# Altium schematic sheet STM32核心系统.SchDoc
size A4
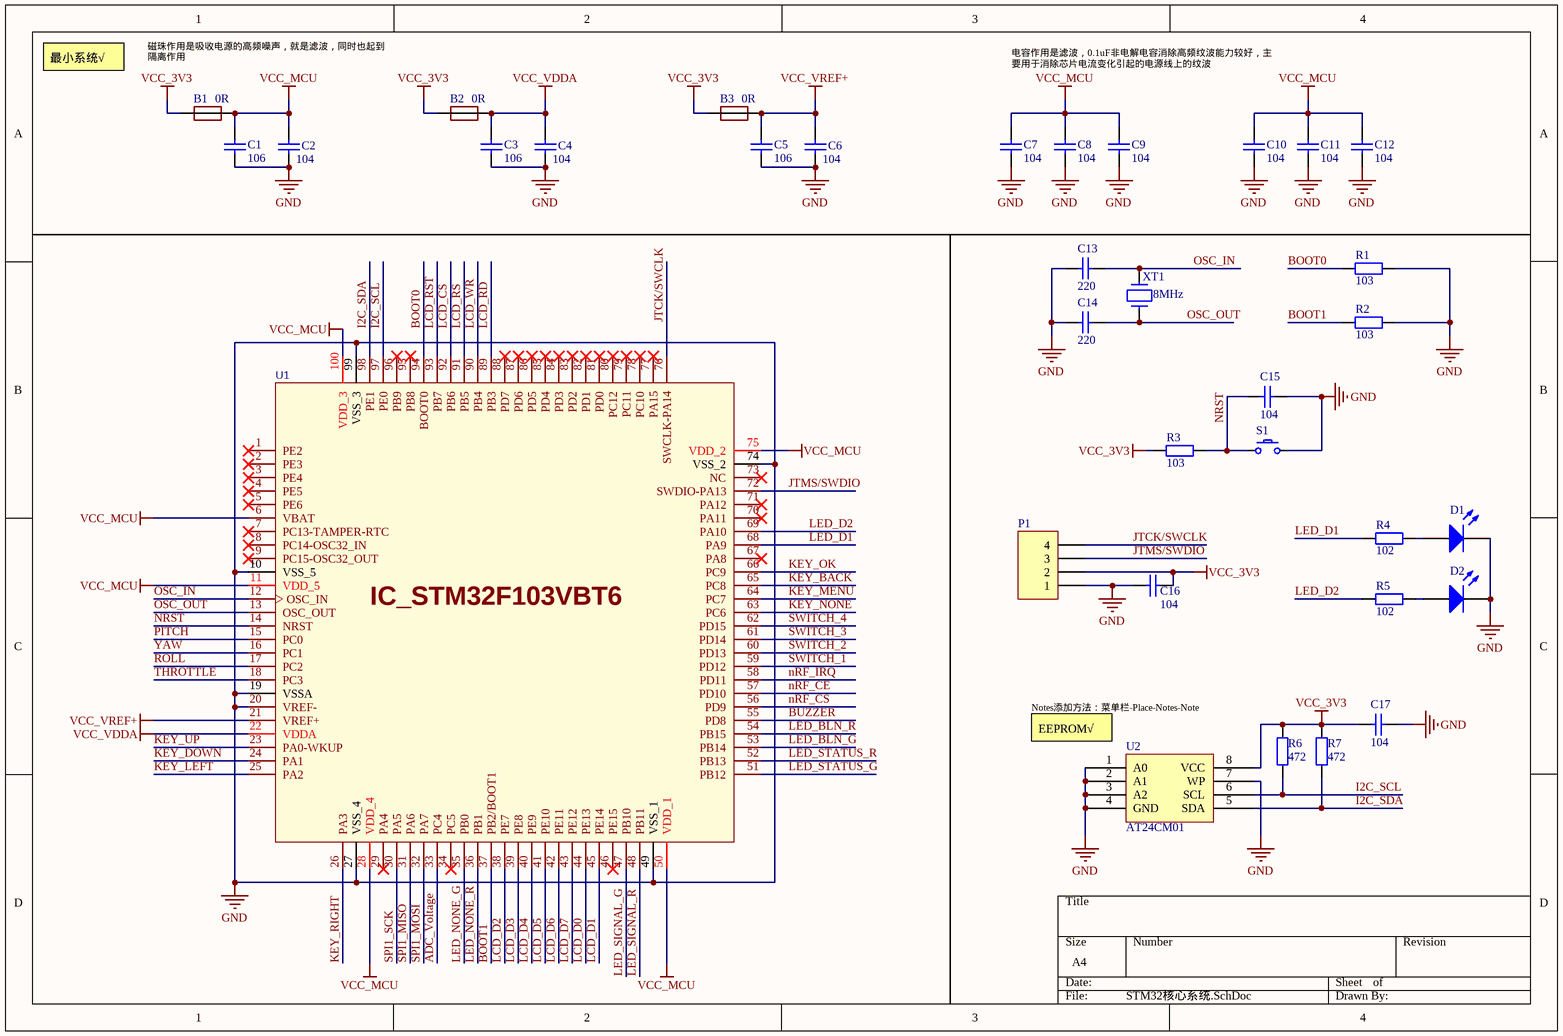
[diagram p0: STM32核心系统.SchDoc]

## Parts
B1  value 0R  [CC1608-0603]  (hidden comment: MPZ1608S101ATDH5)
B2  value 0R  [CC1608-0603]  (hidden comment: MPZ1608S101ATDH5)
B3  value 0R  [CC1608-0603]  (hidden comment: MPZ1608S101ATDH5)
C1  value 106  [CC1608-0603]  (hidden comment: Cap)
C2  value 104  [CC1608-0603]  (hidden comment: Cap)
C3  value 106  [CC1608-0603]  (hidden comment: Cap)
C4  value 104  [CC1608-0603]  (hidden comment: Cap)
C5  value 106  [CC1608-0603]  (hidden comment: Cap)
C6  value 104  [CC1608-0603]  (hidden comment: Cap)
C7  value 104  [CC1608-0603]  (hidden comment: Cap)
C8  value 104  [CC1608-0603]  (hidden comment: Cap)
C9  value 104  [CC1608-0603]  (hidden comment: Cap)
C10  value 104  [CC1608-0603]  (hidden comment: Cap)
C11  value 104  [CC1608-0603]  (hidden comment: Cap)
C12  value 104  [CC1608-0603]  (hidden comment: Cap)
C13  value 220  [CC1608-0603]  (hidden comment: Cap)
C14  value 220  [CC1608-0603]  (hidden comment: Cap)
C15  value 104  [CC1608-0603]  (hidden comment: Cap)
C16  value 104  [CC1608-0603]  (hidden comment: Cap)
C17  value 104  [CC1608-0603]  (hidden comment: Cap)
D1  LED0  [CD1608-0603]  (value not drawn)
D2  LED0  [CD1608-0603]  (value not drawn)
P1  Header 4  [XHT4-2.54]  (value not drawn)
R1  value 103  [CC1608-0603]  (hidden comment: RX_RES)
R2  value 103  [CC1608-0603]  (hidden comment: RX_RES)
R3  value 103  [CC1608-0603]  (hidden comment: RX_RES)
R4  value 102  [CC1608-0603]  (hidden comment: RX_RES)
R5  value 102  [CC1608-0603]  (hidden comment: RX_RES)
R6  value 472  [CC1608-0603]  (hidden comment: RX_RES)
R7  value 472  [CC1608-0603]  (hidden comment: RX_RES)
S1  KG_SW-PB-2  [L7.3X7.3X3.2]  (value not drawn)
U1  IC_STM32F103VBT6  [LQFP-100_L14.0-W14.0-P0.50-LS16.0-BL]
U2  AT24CM01  [SO8]
XT1  value 8MHz  [OSC2-SMD_L5.0-W3.2]  (hidden comment: XT_CRYSTAL2P)

## Nets
GND: C1.1 C2.1 C3.1 C4.1 C5.1 C6.1 C7.1 C8.1 C9.1 C10.1 C11.1 C12.1 C13.2 C14.2 C15.1 C16.1 C17.1 D1.2(K) D2.2(K) P1.1 R1.2 R2.2 S1.2 U1.10(VSS_5) U1.19(VSSA) U1.20(VREF-) U1.27(VSS_4) U1.49(VSS_1) U1.74(VSS_2) U1.99(VSS_3) U2.1(A0) U2.2(A1) U2.3(A2) U2.4(GND) U2.7(WP)
VCC_3V3: B1.1 B2.1 B3.1 C16.2 C17.2 P1.2 R3.1 R6.2 R7.2 U2.8(VCC)
VCC_MCU: B1.2 C1.2 C2.2 C7.2 C8.2 C9.2 C10.2 C11.2 C12.2 U1.6(VBAT) U1.11(VDD_5) U1.28(VDD_4) U1.50(VDD_1) U1.75(VDD_2) U1.100(VDD_3)
VCC_VDDA: B2.2 C3.2 C4.2 U1.22(VDDA)
VCC_VREF+: B3.2 C5.2 C6.2 U1.21(VREF+)
ADC_Voltage: U1.33(PC4)
BOOT0: R1.1 U1.94(BOOT0)
BOOT1: R2.1 U1.37(PB2/BOOT1)
BUZZER: U1.55(PD8)
I2C_SCL: R6.1 U1.97(PE0) U2.6(SCL)
I2C_SDA: R7.1 U1.98(PE1) U2.5(SDA)
JTCK/SWCLK: P1.4 U1.76(SWCLK-PA14)
JTMS/SWDIO: P1.3 U1.72(SWDIO-PA13)
KEY_BACK: U1.65(PC8)
KEY_DOWN: U1.24(PA1)
KEY_LEFT: U1.25(PA2)
KEY_MENU: U1.64(PC7)
KEY_NONE: U1.63(PC6)
KEY_OK: U1.66(PC9)
KEY_RIGHT: U1.26(PA3)
KEY_UP: U1.23(PA0-WKUP)
LCD_CS: U1.92(PB6)
LCD_D0: U1.44(PE13)
LCD_D1: U1.45(PE14)
LCD_D2: U1.38(PE7)
LCD_D3: U1.39(PE8)
LCD_D4: U1.40(PE9)
LCD_D5: U1.41(PE10)
LCD_D6: U1.42(PE11)
LCD_D7: U1.43(PE12)
LCD_RD: U1.89(PB3)
LCD_RS: U1.91(PB5)
LCD_RST: U1.93(PB7)
LCD_WR: U1.90(PB4)
LED_BLN_G: U1.53(PB14)
LED_BLN_R: U1.54(PB15)
LED_D1: R4.1 U1.68(PA9)
LED_D2: R5.1 U1.69(PA10)
LED_NONE_G: U1.35(PB0)
LED_NONE_R: U1.36(PB1)
LED_SIGNAL_G: U1.47(PB10)
LED_SIGNAL_R: U1.48(PB11)
LED_STATUS_G: U1.51(PB12)
LED_STATUS_R: U1.52(PB13)
nRF_CE: U1.57(PD10)
nRF_CS: U1.56(PD9)
nRF_IRQ: U1.58(PD11)
NRST: C15.2 R3.2 S1.1 U1.14(NRST)
OSC_IN: C13.1 U1.12(OSC_IN) XT1.2
OSC_OUT: C14.1 U1.13(OSC_OUT) XT1.1
PITCH: U1.15(PC0)
ROLL: U1.17(PC2)
SPI1_MISO: U1.31(PA6)
SPI1_MOSI: U1.32(PA7)
SPI1_SCK: U1.30(PA5)
SWITCH_1: U1.59(PD12)
SWITCH_2: U1.60(PD13)
SWITCH_3: U1.61(PD14)
SWITCH_4: U1.62(PD15)
THROTTLE: U1.18(PC3)
YAW: U1.16(PC1)
NetD1_1: D1.1(A) R4.2
NetD2_1: D2.1(A) R5.2

Not connected (* = marked no-connect by the designer): U1 1(PE2)* 2(PE3)* 3(PE4)* 4(PE5)* 5(PE6)* 7(PC13-TAMPER-RTC)* 8(PC14-OSC32_IN)* 9(PC15-OSC32_OUT)* 29(PA4)* 34(PC5)* 46(PE15)* 67(PA8)* 70(PA11)* 71(PA12)* 73(NC)* 77(PA15)* 78(PC10)* 79(PC11)* 80(PC12)* 81(PD0)* 82(PD1)* 83(PD2)* 84(PD3)* 85(PD4)* 86(PD5)* 87(PD6)* 88(PD7)* 95(PB8)* 96(PB9)*

## Notes on the sheet
- 最小系统√
- 磁珠作用是吸收电源的高频噪声，就是滤波，同时也起到隔离作用
- 电容作用是滤波，0.1uF非电解电容消除高频纹波能力较好，主要用于消除芯片电流变化引起的电源线上的纹波
- Notes添加方法：菜单栏-Place-Notes-Note
- (near U2) EEPROM√

## Library data of the parts
B1-B3 = FB_BEAD: 磁珠
C1-C17 = Cap: Capacitor; Published: 8-Jun-2000; LatestRevisionDate: 17-Jul-2002; LatestRevisionNote: Re-released for DXP Platform.; PackageReference: RAD-0.3; Publisher: Altium Limited; PackageDescription: Radial Cap, Thru-Hole; 2 Leads; 0.3 in Pin Spacing
D1 D2 = LED0: Typical INFRARED GaAs LED; Published: 8-Jun-2000; LatestRevisionDate: 08-Jul-2005; LatestRevisionNote: Mech Layer 1 removed.; PackageReference: LED-0; Publisher: Altium Limited; PackageDescription: LED; 2 Leads
P1 = Header 4: Header, 4-Pin; LatestRevisionDate: 17-Jul-2002; LatestRevisionNote: Re-released for DXP Platform.; Publisher: Altium Limited
R1-R7 = RX_RES: 电阻
S1 = KG_SW-PB-2: 2脚开关
U1 = IC_STM32F103VBT6: STM32单片机; BOM_Manufacturer: ST; subpart_no: 2; tags: STM32; BOM_Supplier Part: C8314; BOM_Supplier: LCSC; BOM_Manufacturer Part: STM32F103VBT6; image: http://image.lceda.cn/szlcsc/C8314.jpg; spicePre: U
U2 = IC_AT24C02: 存储芯片
XT1 = XT_CRYSTAL2P: 2P晶振